# Altium schematic sheet Ethernet PHY.SchDoc
size 317 x 190 mm
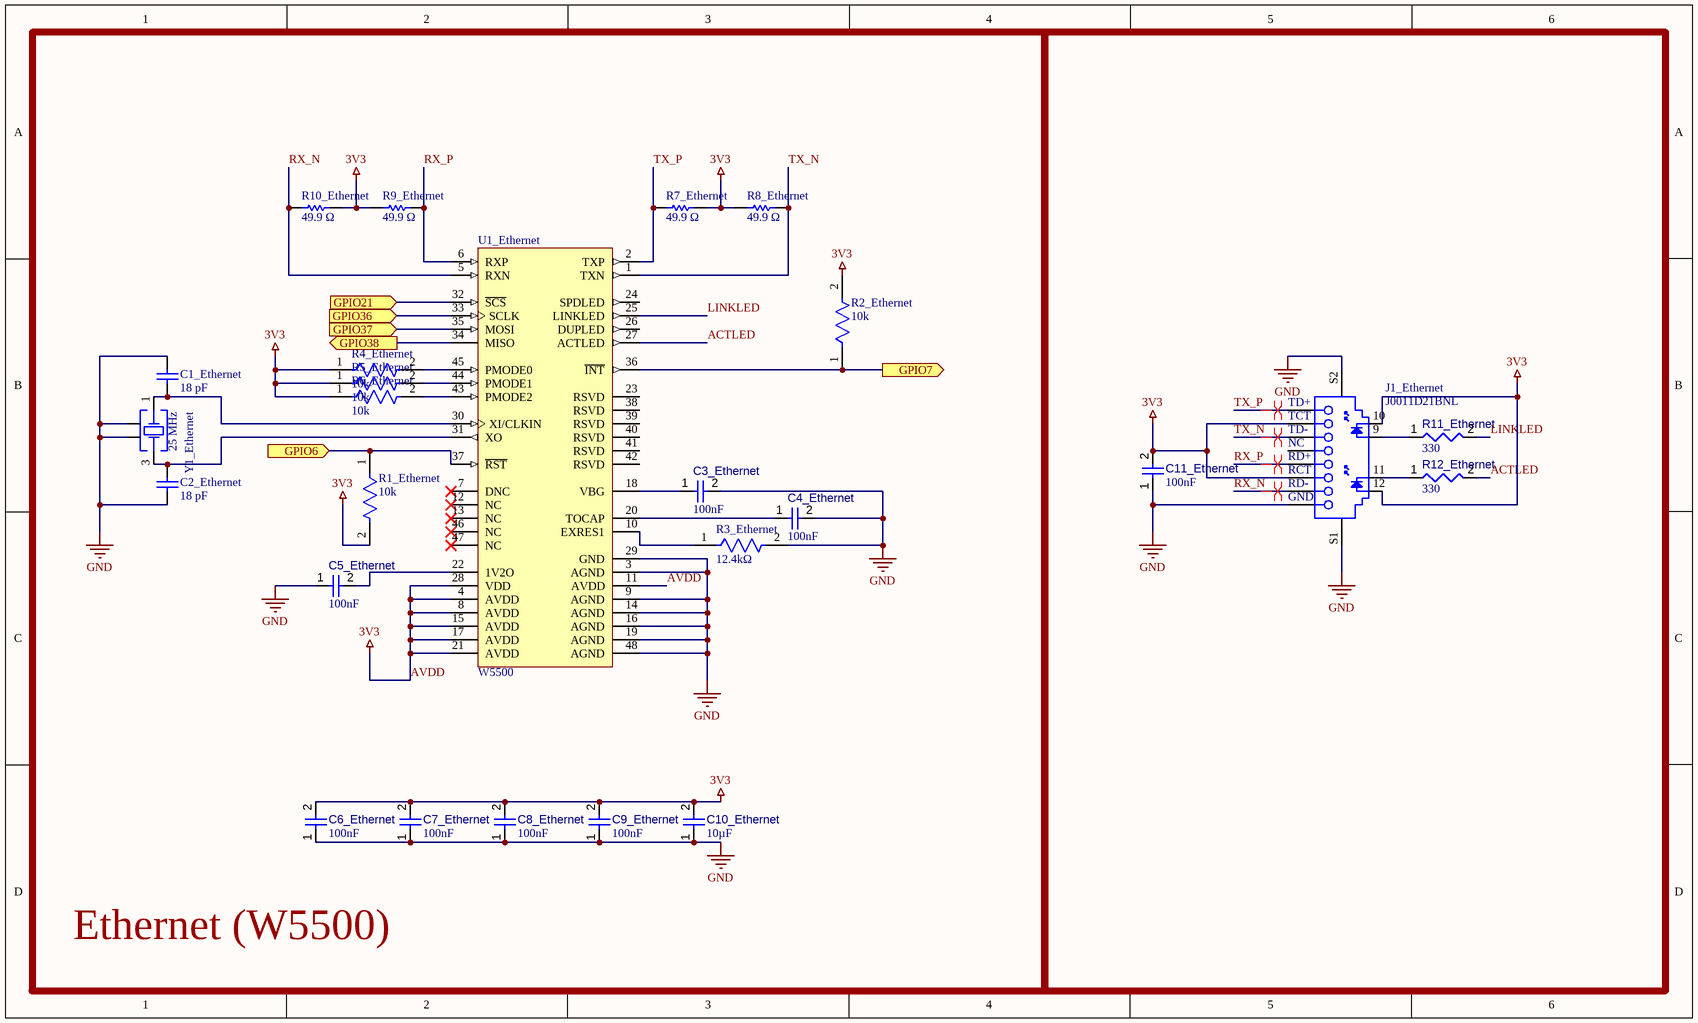
[diagram p0: Ethernet PHY.SchDoc]

## Parts
C1_Ethernet  18 pF  [CAPC1608X90X35LL10T15]
C2_Ethernet  18 pF  [CAPC1608X90X35LL10T15]
C3_Ethernet  value 100nF  [CAPC0402(1005)60_L]  (hidden comment: Capacitor 100nF +/-20% 10V 0402)
C4_Ethernet  value 100nF  [CAPC0402(1005)60_L]  (hidden comment: Capacitor 100nF +/-20% 10V 0402)
C5_Ethernet  value 100nF  [CAPC0402(1005)60_L]  (hidden comment: Capacitor 100nF +/-20% 10V 0402)
C6_Ethernet  value 100nF  [CAPC0402(1005)60_L]  (hidden comment: Capacitor 100nF +/-20% 10V 0402)
C7_Ethernet  value 100nF  [CAPC0402(1005)60_L]  (hidden comment: Capacitor 100nF +/-20% 10V 0402)
C8_Ethernet  value 100nF  [CAPC0402(1005)60_L]  (hidden comment: Capacitor 100nF +/-20% 10V 0402)
C9_Ethernet  value 100nF  [CAPC0402(1005)60_L]  (hidden comment: Capacitor 100nF +/-20% 10V 0402)
C10_Ethernet  value 10µF  [CAPC0603(1608)100_L]  (hidden comment: Capacitor 10µF +/-20% 10V 0603)
C11_Ethernet  value 100nF  [CAPC0402(1005)60_L]  (hidden comment: Capacitor 100nF +/-20% 10V 0402)
J1_Ethernet  J0011D21BNL  [PULS-J00XXD21XNL-B-12]
R1_Ethernet  value 10k  [FP-CRGCQ1206-IPC_C]  (hidden comment: CRGCQ1206F10K)
R2_Ethernet  value 10k  [FP-CRGCQ1206-IPC_C]  (hidden comment: CRGCQ1206F10K)
R3_Ethernet  12.4kΩ  [FP-TFCR0805-IPC_C]
R4_Ethernet  value 10k  [FP-CRGCQ1206-IPC_C]  (hidden comment: CRGCQ1206F10K)
R5_Ethernet  value 10k  [FP-CRGCQ1206-IPC_C]  (hidden comment: CRGCQ1206F10K)
R6_Ethernet  value 10k  [FP-CRGCQ1206-IPC_C]  (hidden comment: CRGCQ1206F10K)
R7_Ethernet  49.9 Ω  [RESC1608X55X25NL10T15]
R8_Ethernet  49.9 Ω  [RESC1608X55X25NL10T15]
R9_Ethernet  49.9 Ω  [RESC1608X55X25NL10T15]
R10_Ethernet  49.9 Ω  [RESC1608X55X25NL10T15]
R11_Ethernet  value 330  [RESC0402(1005)_L]  (hidden comment: Resistor 330R +/-5 % 0402 63 mW)
R12_Ethernet  value 330  [RESC0402(1005)_L]  (hidden comment: Resistor 330R +/-5 % 0402 63 mW)
U1_Ethernet  W5500  [WIZ-W5500-LQFP-48_M]
Y1_Ethernet  25 MHz  [WE-XTAL_CFPX-180]

## Blocks framed on the sheet
Ethernet (W5500): C1_Ethernet C2_Ethernet C3_Ethernet C4_Ethernet C5_Ethernet C6_Ethernet C7_Ethernet C8_Ethernet C9_Ethernet C10_Ethernet R1_Ethernet R2_Ethernet R3_Ethernet R4_Ethernet R5_Ethernet R6_Ethernet R7_Ethernet R8_Ethernet R9_Ethernet R10_Ethernet U1_Ethernet Y1_Ethernet

## Ports
GPIO6 (in), GPIO7 (out), GPIO21 (in), GPIO36 (in), GPIO37 (in), GPIO38 (out)

## Nets
AVDD: C6_Ethernet.2 C7_Ethernet.2 C8_Ethernet.2 C9_Ethernet.2 C10_Ethernet.2 C11_Ethernet.2 J1_Ethernet.4(TCT) J1_Ethernet.5(RCT) J1_Ethernet.10 J1_Ethernet.12 R1_Ethernet.2 R2_Ethernet.2 R4_Ethernet.1 R5_Ethernet.1 R6_Ethernet.1 R7_Ethernet.2 R8_Ethernet.1 R9_Ethernet.1 R10_Ethernet.2 U1_Ethernet.4(AVDD) U1_Ethernet.8(AVDD) U1_Ethernet.11(AVDD) U1_Ethernet.15(AVDD) U1_Ethernet.17(AVDD) U1_Ethernet.21(AVDD) U1_Ethernet.28(VDD)  [also labelled 3V3]
GND: C1_Ethernet.2 C2_Ethernet.1 C3_Ethernet.2 C4_Ethernet.2 C5_Ethernet.1 C6_Ethernet.1 C7_Ethernet.1 C8_Ethernet.1 C9_Ethernet.1 C10_Ethernet.1 C11_Ethernet.1 J1_Ethernet.8(CHS_GROUND) J1_Ethernet.S1 J1_Ethernet.S2 R3_Ethernet.2 U1_Ethernet.3(AGND) U1_Ethernet.9(AGND) U1_Ethernet.14(AGND) U1_Ethernet.16(AGND) U1_Ethernet.19(AGND) U1_Ethernet.29(GND) U1_Ethernet.48(AGND) Y1_Ethernet.2(GND&Lid) Y1_Ethernet.4(GND&Lid)
ACTLED: R12_Ethernet.2 U1_Ethernet.27(ACTLED)
GPIO6: R1_Ethernet.1 U1_Ethernet.37(~{RST}) ; port GPIO6
GPIO7: R2_Ethernet.1 U1_Ethernet.36(~{INT}) ; port GPIO7
GPIO21: U1_Ethernet.32(~{SCS}) ; port GPIO21
GPIO36: U1_Ethernet.33(SCLK) ; port GPIO36
GPIO37: U1_Ethernet.35(MOSI) ; port GPIO37
GPIO38: U1_Ethernet.34(MISO) ; port GPIO38
LINKLED: R11_Ethernet.2 U1_Ethernet.25(LINKLED)
RX_N: J1_Ethernet.6(RD-) R10_Ethernet.1 U1_Ethernet.5(RXN)
RX_P: J1_Ethernet.3(RD+) R9_Ethernet.2 U1_Ethernet.6(RXP)
TX_N: J1_Ethernet.2(TD-) R8_Ethernet.2 U1_Ethernet.1(TXN)
TX_P: J1_Ethernet.1(TD+) R7_Ethernet.1 U1_Ethernet.2(TXP)
NetC1_Ethernet_1: C1_Ethernet.1 U1_Ethernet.30(XI/CLKIN) Y1_Ethernet.1(Crystal)
NetC2_Ethernet_2: C2_Ethernet.2 U1_Ethernet.31(XO) Y1_Ethernet.3(Crystal)
NetC3_Ethernet_1: C3_Ethernet.1 U1_Ethernet.18(VBG)
NetC4_Ethernet_1: C4_Ethernet.1 U1_Ethernet.20(TOCAP)
NetC5_Ethernet_2: C5_Ethernet.2 U1_Ethernet.22(1V2O)
NetJ1_Ethernet_9: J1_Ethernet.9 R11_Ethernet.1
NetJ1_Ethernet_11: J1_Ethernet.11 R12_Ethernet.1
NetR3_Ethernet_1: R3_Ethernet.1 U1_Ethernet.10(EXRES1)
NetR4_Ethernet_2: R4_Ethernet.2 U1_Ethernet.45(PMODE0)
NetR5_Ethernet_2: R5_Ethernet.2 U1_Ethernet.44(PMODE1)
NetR6_Ethernet_2: R6_Ethernet.2 U1_Ethernet.43(PMODE2)

Not connected (* = marked no-connect by the designer): J1_Ethernet 7(NC); U1_Ethernet 7(DNC)* 12(NC)* 13(NC)* 23(RSVD) 24(SPDLED) 26(DUPLED) 38(RSVD) 39(RSVD) 40(RSVD) 41(RSVD) 42(RSVD) 46(NC)* 47(NC)*

## Layout directives
differential pair: RX_N, RX_P, TX_N, TX_P

## Notes on the sheet
- (in symbol CMP-2000-05321-1) GND

## Library data of the parts
C1_Ethernet C2_Ethernet = CMP-2000-06334-1: Chip Capacitor, 18 pF, +/- 5%, 50 V, -55 to 125 degC, 0603 (1608 Metric), RoHS, Tape and Reel; Manufacturer: Murata; Capacitance: 18pF; Voltage - Rated: 50V; Online Catalog: GRMSeries; Temperature Coefficient: C0G,NP0; Other Names: 490-1409-2GRM39C0G180J050AD; Package / Case: 0603(1608Metric); Package Reference: 0603; Height - Seated (Max): -; Package Description: 2-Pin Surface Mount Device, Body 1.6 x 0.8 mm; Category: Capacitors; Applications: GeneralPurpose; Size / Dimension: 0.063"Lx0.031"W(1.60mmx0.80mm); Mounting Type: SurfaceMount,MLCC; Family: CeramicCapacitors; Packaging: Tape&Reel(TR); Tolerance: ±5%; Ratings: -; Operating Temperature: -55°C~125°C; Datasheet URL: http://search.murata.co.jp/Ceramy/image/img/A01X/G101/ENG/GRM1885C1H180JA01-01.pdf; Standard Package: 4,000; Lead Style: -; Thickness (Max): 0.035"(0.90mm); Manufacturer URL: http://www.murata.com/; Mounting Technology: SurfaceMount; Lead Spacing: -; Series: GRM; Features: -; Datasheet Version: 03/2016
C3_Ethernet C4_Ethernet C5_Ethernet C6_Ethernet C7_Ethernet C8_Ethernet C9_Ethernet C11_Ethernet = CMP-001-00061-3: Chip Capacitor, 100nF +/-20%, 10V, 0402, Thickness 0.6 mm; Tolerance: 20%; Mounting Technology: SMT; Voltage Rating: 10V; Max Operating Temperature: 85°C; Pins: 2; Case/Package: 0402; Min Operating Temperature: -55°C
C10_Ethernet = CMP-001-00075-4: Chip Capacitor, 10µF +/-20%, 10V, 0603, Thickness 1 mm; Tolerance: 10%; Voltage Rating: 10V; Max Operating Temperature: 85°C; Pins: 2; Case/Package: 0603; Mounting Technology: SMT; Min Operating Temperature: -55°C
J1_Ethernet = CMP-2000-05321-1: 10/100 Base-TX RJ45 1 x 1 Tab-Down with LEDs Integrated Magnetics Connector, 0 to 70 degC, 12-Pin THD, RoHS, Tube; Manufacturer: Pulse; Body Orientation: RightAngle; Number of Contacts: 8; Gender: F; Pitch: 2.54mm; Category: ConnectorTelephoneandTelecom; Package Description: 12-Pin Through Hole Device, Body 16.26 x 21.59 mm, Pitch 1.27 mm; Datasheet Version: Rev. D, 05/2006; Termination Method: Solder; Type: RJ-45; Package Reference: J0011D21BNL; Manufacturer URL: http://www.pulseelectronics.com/; Mounting: ThroughHole; Datasheet URL: http://datasheet.octopart.com/J0011D21BNL-Pulse-datasheet-120436.pdf
R1_Ethernet R2_Ethernet R4_Ethernet R5_Ethernet R6_Ethernet = CMP-009-00179-1: Res Thick Film 1206 10K Ohm 1% 0.25W(1/4W) ±100ppm/C Pad SMD Automotive T/R; Manufacturer Lifecycle Status: ACTIVE; Operating Supply Voltage: 200V; Temperature Coefficient: 100ppm/°C; Power Rating: 250mW; Case/Package: 1206; Export Control Classification Number (ECCN) Code: EAR99; REACH SVHC: Yes; Mounting Technology: Surface Mount; Voltage Rating (DC): 200V; Ambient Temperature Range High: 70°C; Introduction Date: 2018-03-13; Min Operating Temperature: -55°C; Width: 1.55mm; Packaging: Cut Tape; Voltage Rating: 200V; Ratings: AEC-Q200; Max Operating Temperature: 155°C; Number of Terminals: 2; Composition: Thick Film; Lifecycle Status: Production; Schedule B: 8533210025, 8533210025; China RoHS: Non-Compliant; Harmonized Tariff Schedule (HTS) Code: 8533.21.00.30; Length: 3.1mm; Working Voltage: 200V; Tolerance: 1%; RoHS: Compliant; Height: 550µm
R3_Ethernet = CMP-250906-053812-1: RES Thin Film,  12.4kΩ, 0.1%, 0.1W, 25ppm/°C, 0805; RoHS Compliant: Yes
R7_Ethernet R8_Ethernet R9_Ethernet R10_Ethernet = CMP-1659-00036-1: General Purpose Chip Resistor, 49.9 Ohm, +/- 1%, -55 to 155 degC, 0603 (1608 Metric), RoHS, Tape and Reel; Max Supply Voltage: 3.63 V; Case\Package: LQFP; Interface: SPI; Min Supply Voltage: 2.97 V; PackageReference: 0603; Packaging: Tray; ComponentLink2Description: Datasheet; ComponentLink1Description: Manufacturer URL; ComponentLink2URL: https://datasheet.ciiva.com/11808/0900766b80f96399-11808223.pdf; RoHSCompliant: true; Max Operating Temperature: 85 degC; ComponentLink1URL: http://www.yageo.com/; PackageDescription: 2-Pin Surface Mount Device, Body 1.6 x 0.8 mm; DatasheetVersion: Rev. 4, 04/2009; Min Operating Temperature: -40 degC; Package Quantity: 250; Pins: 48
R11_Ethernet R12_Ethernet = CMP-009-00132-3: Chip Resistor, 330 Ohms, +/-5 %, 63 mW, -55 to 155 degC, 0402; Power: 63mW; Tolerance: 5%; Pins: 2; Max Operating Temperature: 155°C; Min Operating Temperature: -55°C; Case/Package: 0402
U1_Ethernet = CMP-020-00020-3: Hardwired TCP/IP Embedded Ethernet Controller, 3.3 V, 25 MHz, -40 to 85 degC, 48-Pin LQFP, RoHS, Tray; Manufacturer: WIZnet; Interface: SPI; Min Supply Voltage: 2.97V; Max Supply Voltage: 3.63V; Package Quantity: 250; Package Description: 48-Pin Low-profile Quad Flat Package, Body 7.00 x 7.00 mm, Pitch 0.50 mm; Package Reference: LQFP-48; Case/Package: LQFP; RoHS Compliant: True; Mounting Technology: SM; Datasheet URL: http://wizwiki.net/wiki/lib/exe/fetch.php?media=products:w5500:w5500_ds_v106e_141230.pdf; Manufacturer URL: http://www.wiznet.co.kr/; Packaging: Tray; Min Operating Temperature: -40°C; Pins: 48; Datasheet Version: Rev. 1.0.6, 12/2014; Max Operating Temperature: 85°C
Y1_Ethernet = CMP-03913-116876467-2: WE-XTAL Quartz Crystal; Frequency: 25MHz; Max Operating Temperature: 85°C; Width: 2.5mm; Height: 800µm; Length: 3.2mm; Min Operating Temperature: -40°C